# Altium schematic sheet CAN.SchDoc
size A4
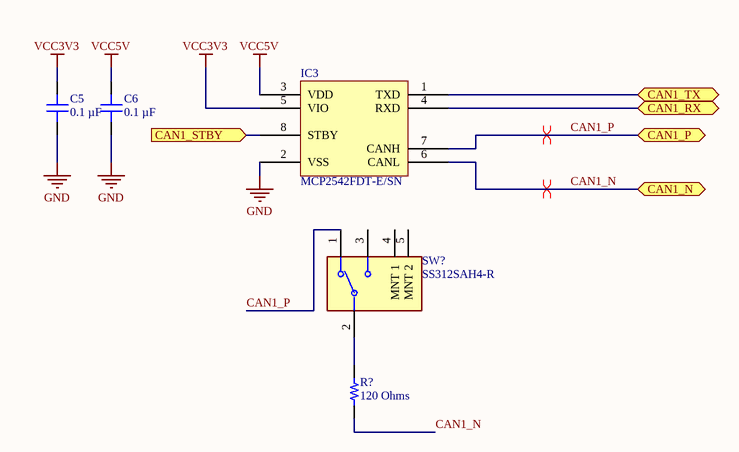
[diagram p0: CAN.SchDoc]

## Parts
C5  0.1 µF  [CAP 0603_1608]
C6  0.1 µF  [CAP 0603_1608]
IC3  MCP2542FDT-E/SN  [MICROCHIP SOIC-8 150MIL WIDE]
R?  120 Ohms  [RES 0201_0603]
SW?  SS312SAH4-R  [FP-SS312SAH4-R-MFG]

## Ports
CAN1_N (bidir), CAN1_P (bidir), CAN1_RX (bidir), CAN1_STBY (in), CAN1_TX (bidir)

## Nets
GND: C5.1 C6.1 IC3.2(VSS)
VCC3V3: C5.2 IC3.5(VIO)
VCC5V: C6.2 IC3.3(VDD)
CAN1_N: IC3.6(CANL) R?.1 ; port CAN1_N
CAN1_P: IC3.7(CANH) SW?.1 ; port CAN1_P
CAN1_RX: IC3.4(RXD) ; port CAN1_RX
CAN1_STBY: IC3.8(STBY) ; port CAN1_STBY
CAN1_TX: IC3.1(TXD) ; port CAN1_TX
NetR?_2: R?.2 SW?.2(COM)

Not connected (* = marked no-connect by the designer): SW? 3 4(MNT_1) 5(MNT_2)

## Layout directives
differential pair: CAN1_N, CAN1_P

## Library data of the parts
C5 C6 = C0603C104K5RAC7411: CAP CER 0.1UF 50V X7R 0603; manufacturer: KEMET; Tolerance: ±10%; Part Number: C0603C104K5RAC7411; Value: 0.1 µF; Applications: Bypass, Decoupling; Capacitance: 0.1 µF; componentlink1description: Datasheet; componentlink1url: https://api.kemet.com/component-edge/download/datasheet/C0603C104K5RAC7411.pdf; componentlink2description: DigiKey Link; componentlink2url: https://www.digikey.com/en/products/detail/kemet/C0603C104K5RAC7411/3317013; Device Package: 0603 (1608 Metric); lastupdated: 2023-12-23 8:10:44 PM; Lifecycle Status: Active; Minimum Order: 1; Mounting Type: Surface Mount, MLCC; Operating Temperature: -55°C ~ 125°C; Package / Case: 0603 (1608 Metric); packaging: TapeAndReel; partid: 2233; Part Status: Active; price: 0.01; series: SMD Comm X7R; Size / Dimension: 0.063" L x 0.031" W (1.60mm x 0.80mm); Supplier 1: DigiKey; Supplier Part Number 1: 399-C0603C104K5RAC7411CT-ND; Temperature Coefficient: X7R; Thickness (Max): 0.035" (0.90mm); Voltage - Rated: 50V
IC3 = MCP2542FDT-E/SN: IC TRANSCEIVER 1/1 8SOIC; Manufacturer: Microchip Technology; Data Rate: 8Mbps; Protocol: CANbus; Receiver Hysteresis: 200mV; Voltage - Supply: 4.5V ~ 5.5V; Part Number: MCP2542FDT-E/SN; ComponentLink1Description: Datasheet; ComponentLink1URL: http://www.microchip.com/mymicrochip/filehandler.aspx?ddocname=en585412; ComponentLink2Description: DigiKey Link; ComponentLink2URL: http://digikey.com/product-detail/en/microchip-technology/MCP2542FDT-E-SN/MCP2542FDT-E-SNCT-ND/9642863; Device Package: 8-SOIC (0.154", 3.90mm Width); LastUpdated: 2020-05-24 11:07:13 PM; Lifecycle Status: Active; Minimum Order: 1; Mounting Type: Surface Mount; Number of Drivers/Receivers: 1/1; Operating Temperature: -40°C ~ 125°C; Package / Case: 8-SOIC (0.154", 3.90mm Width); Packaging: TapeAndReel; Part Status: Active; Price: 0.59; Series: -; Supplier 1: DigiKey; Supplier Part Number 1: MCP2542FDT-E/SNCT-ND; Supplier Device Package: 8-SOIC; Type: Transceiver
R? = RMCF0201JT120R: RES 120 OHM 5% 1/20W 0201; Manufacturer: Stackpole Electronics Inc; Power (Watts): 0.05W, 1/20W; Temperature Coefficient: ±200ppm/°C; Part Number: RMCF0201JT120R; Value: 120 Ohms; ComponentLink1Description: Datasheet; ComponentLink1URL: https://www.seielect.com/catalog/sei-rmcf_rmcp.pdf; ComponentLink2Description: DigiKey Link; ComponentLink2URL: https://www.digikey.com/en/products/detail/stackpole-electronics-inc/RMCF0201JT120R/5966040; Composition: Thick Film; Device Package: 0201 (0603 Metric); Height - Seated (Max): 0.010" (0.26mm); LastUpdated: 2023-12-23 8:21:05 PM; Lifecycle Status: Active; Minimum Order: 1; Number of Terminations: 2; Operating Temperature: -55°C ~ 155°C; Package / Case: 0201 (0603 Metric); Packaging: CutTape; PartId: 197; Part Status: Active; Price: 0.01; Ratings: AEC-Q200; Resistance: 120 Ohms; Series: RMCF; Size / Dimension: 0.024" L x 0.012" W (0.60mm x 0.30mm); Supplier 1: DigiKey; Supplier Part Number 1: 738-RMCF0201JT120RCT-ND; Supplier Device Package: 0201; Tolerance: ±5%
SW? = CMP-31746-000001-1: SWITCH SLIDE SPDT 0.4VA 28V; Mechanical Life: 10000Cycles; Switch Function: On-On; Actuator Length: 2mm; Contact Style: Shorting; Max Current Rating: 100mA; Actuator Type: Standard; Actuator Material: Polyphenylene; Length: 10.5mm; Orientation: Right Angle; Voltage Rating (DC): 28V; Contact Material: Bronze; Electrical Life: 10000Cycles; Max Operating Temperature: 85°C; Case/Package: SMD/SMT; Depth: 7.45mm; Contact Plating: Gold; Voltage Rating (AC): 28V; Package Quantity: 1; Min Operating Temperature: -25°C; Switch Travel: 2mm; Housing Material: Bronze; RoHS Compliant: Yes; Lead Free: Lead Free; Termination: Gull Wing; Packaging: Tape and Reel; REACH SVHC: No SVHC; Mount: Surface Mount; Series: SS3; Throw Configuration: SPDT; Max Voltage Rating (AC): 28V; Max Voltage Rating (DC): 28V